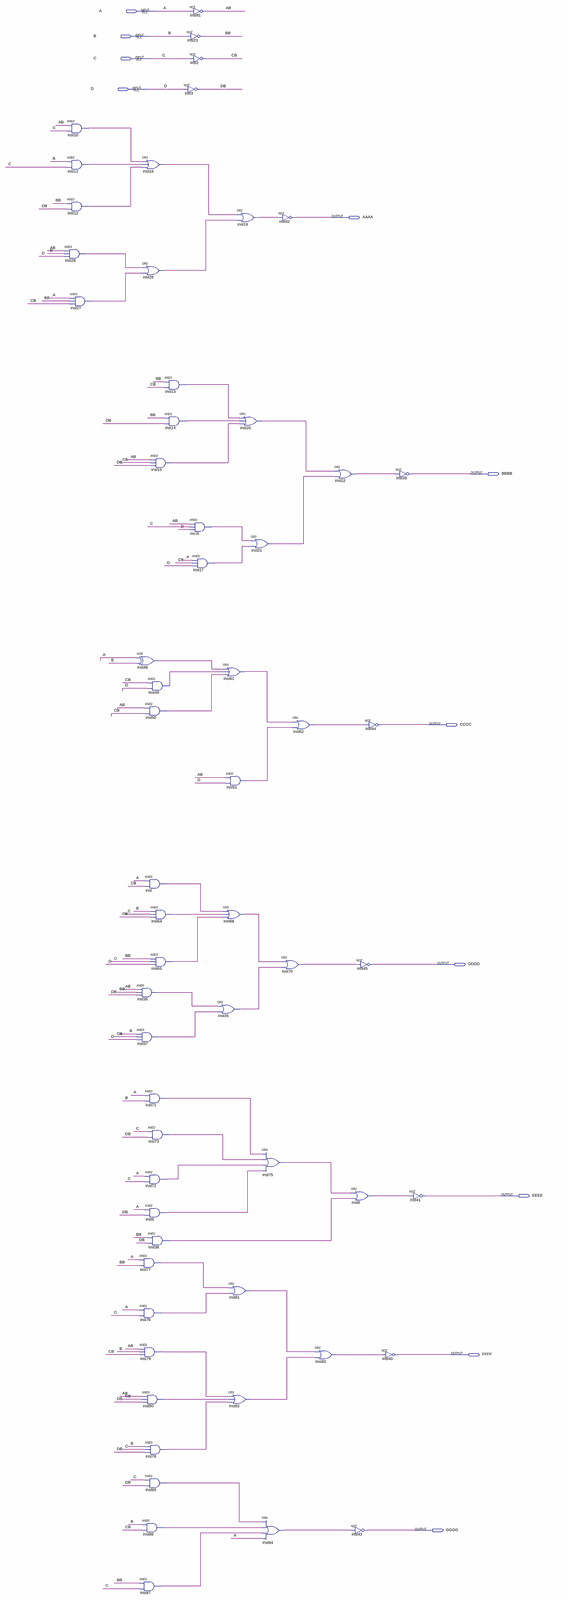
[diagram p0: schematic sheet, whole]
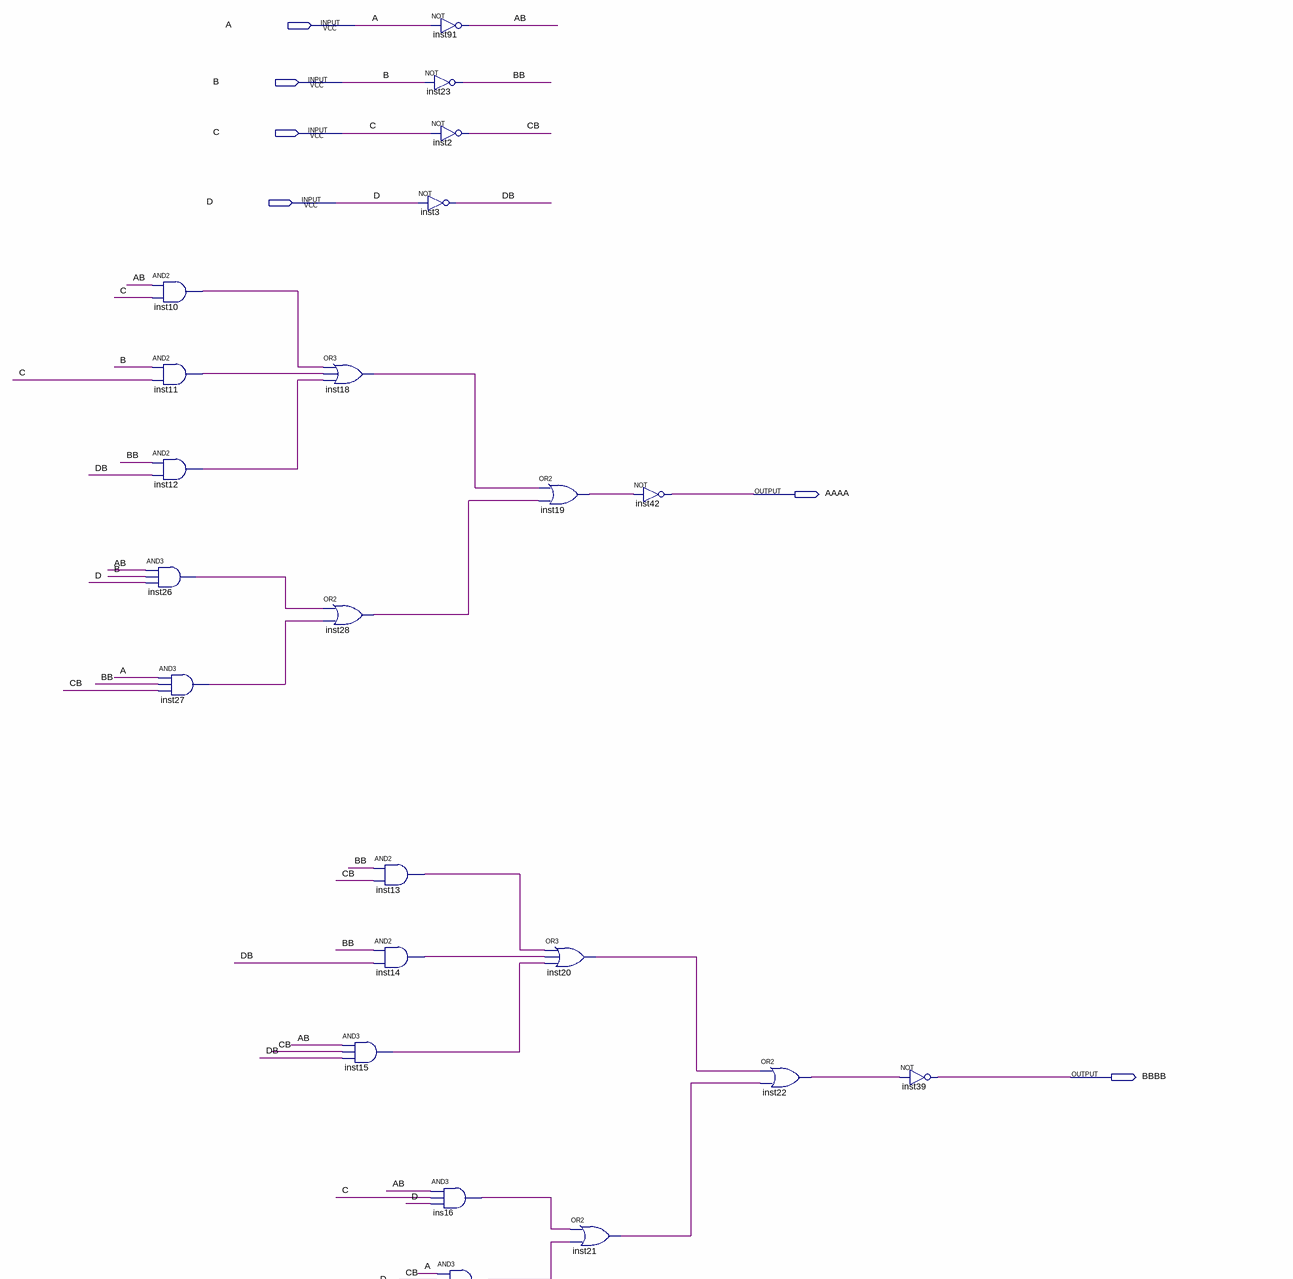
[diagram p1: schematic sheet, upper part]
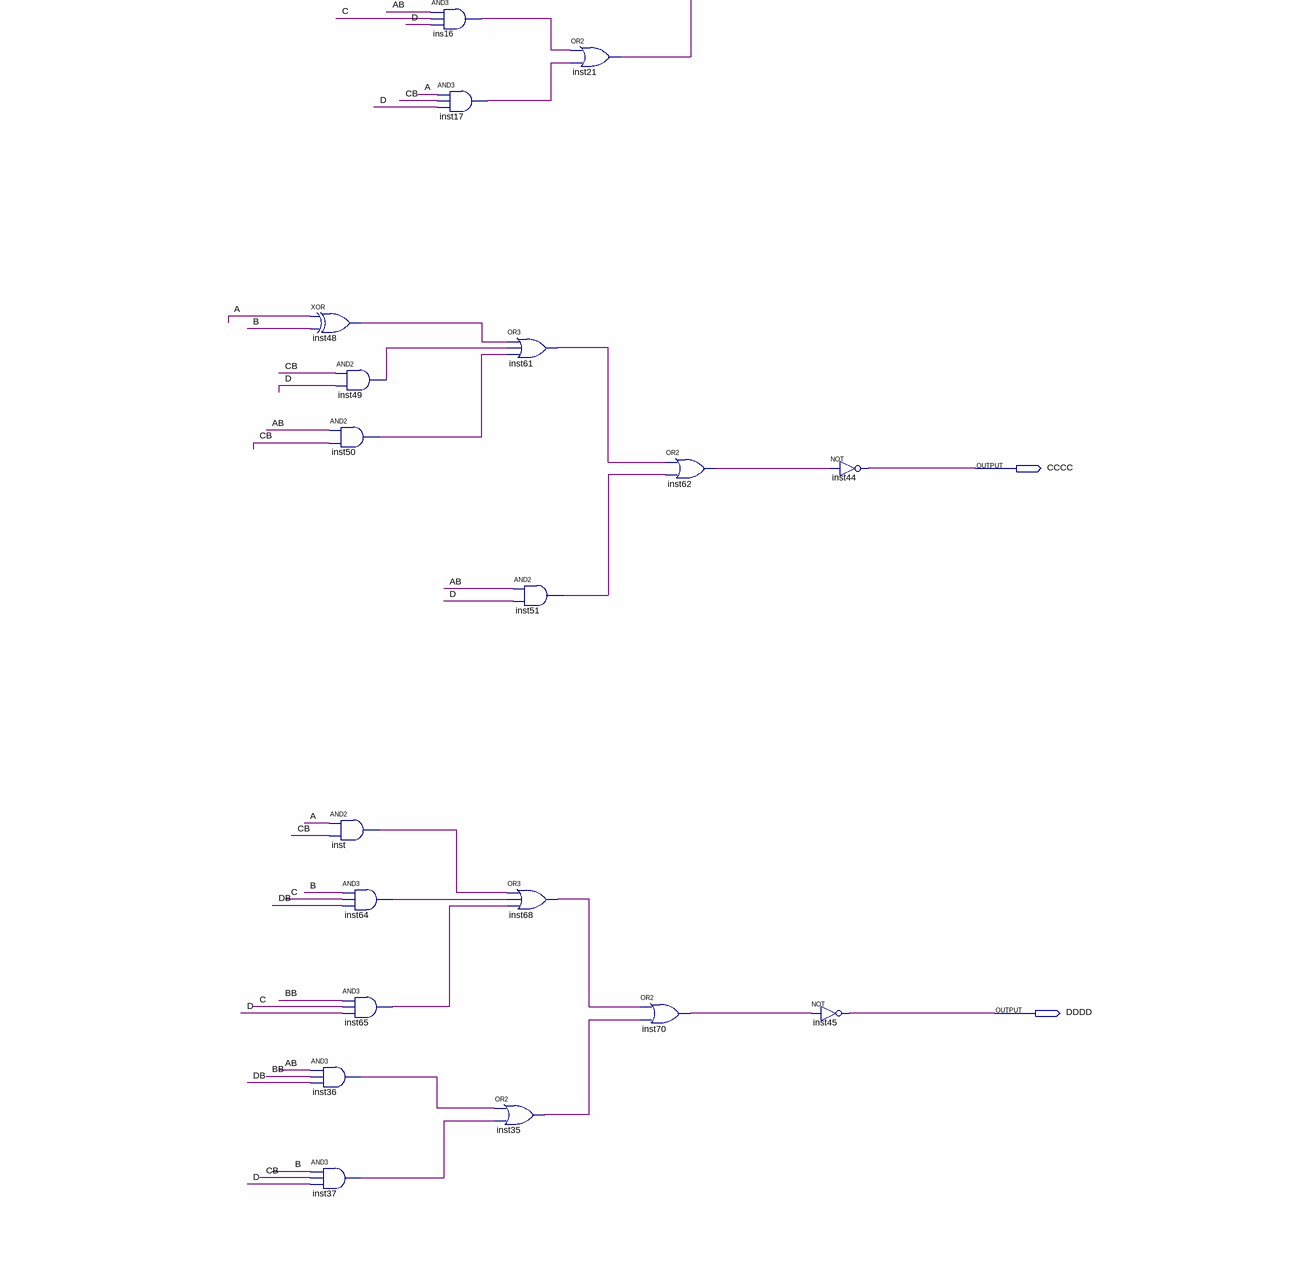
[diagram p2: schematic sheet, middle part]
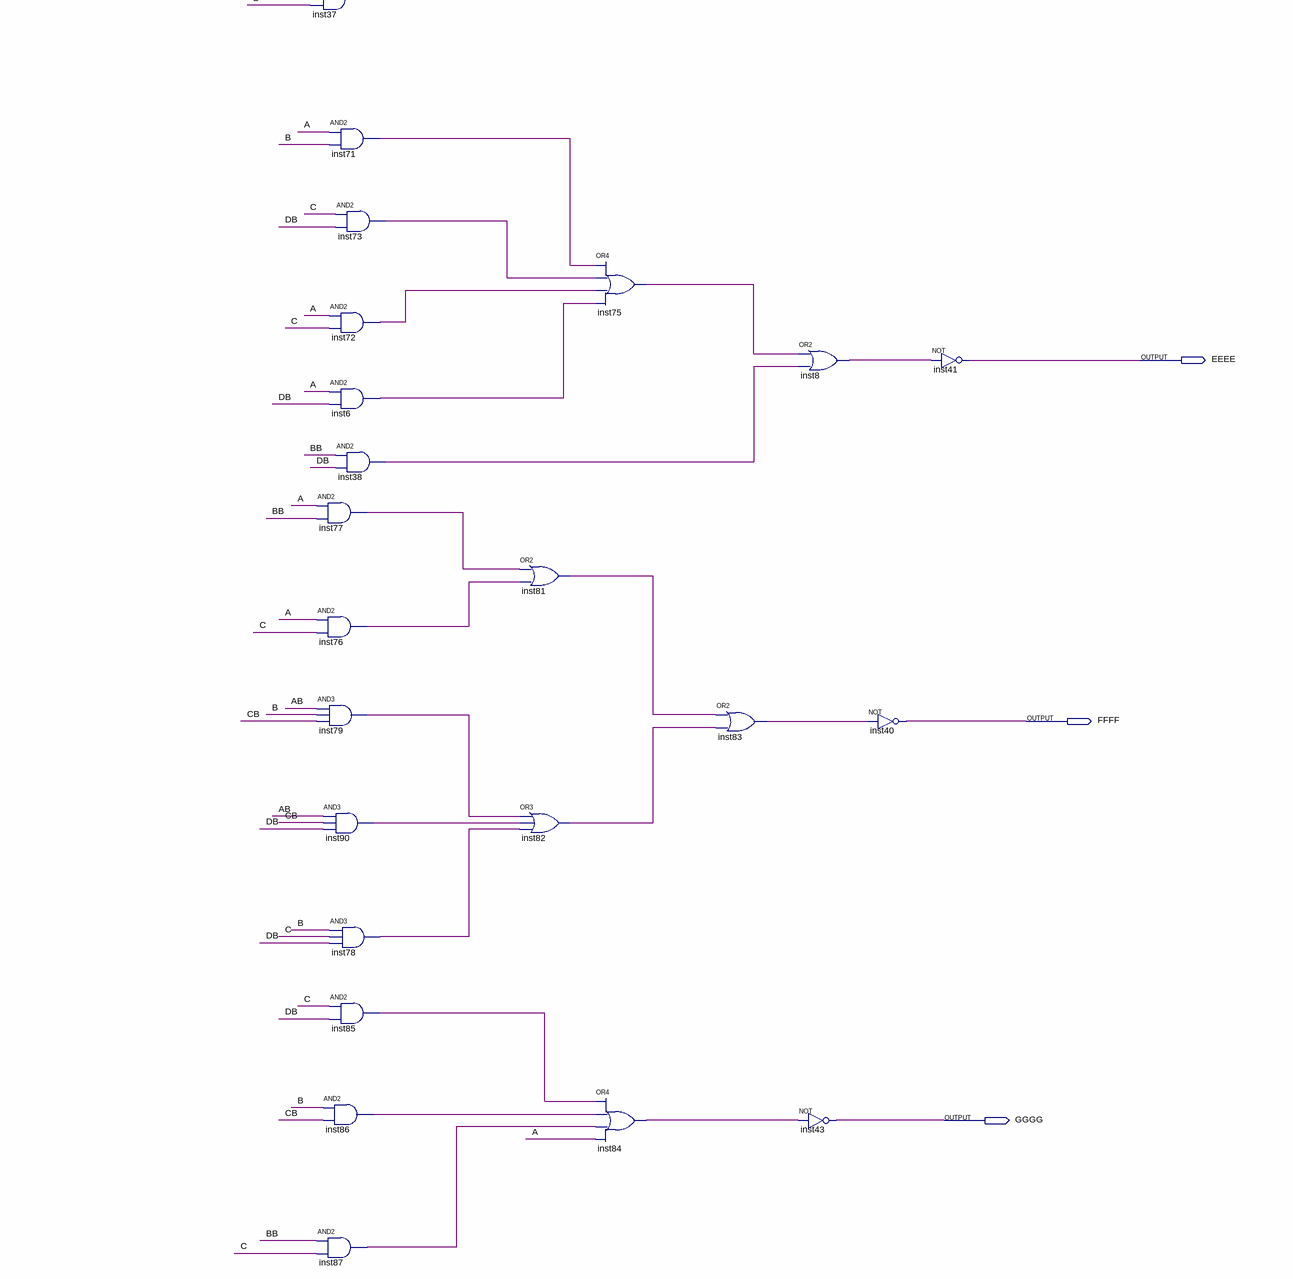
[diagram p3: schematic sheet, lower part]
// Quartus schematic projeto05.bdf as structural Verilog: 60 symbols, 11 pins
module projeto05 (
  input  A,
  input  B,
  input  C,
  input  D,
  output AAAA,
  output BBBB,
  output CCCC,
  output DDDD,
  output EEEE,
  output FFFF,
  output GGGG
);

  wire AB, BB, CB, DB, ins16_out, inst6_out, inst8_out, inst10_out, inst11_out, inst12_out, inst13_out,
       inst14_out, inst15_out, inst17_out, inst18_out, inst19_out, inst20_out, inst21_out, inst22_out,
       inst26_out, inst27_out, inst28_out, inst35_out, inst36_out, inst37_out, inst38_out, inst48_out,
       inst49_out, inst50_out, inst51_out, inst61_out, inst62_out, inst64_out, inst65_out, inst68_out,
       inst70_out, inst71_out, inst72_out, inst73_out, inst75_out, inst76_out, inst77_out, inst78_out,
       inst79_out, inst81_out, inst82_out, inst83_out, inst84_out, inst85_out, inst86_out, inst87_out,
       inst90_out, inst_out;

  and inst10 (inst10_out, AB, C);
  and inst11 (inst11_out, B, C);
  and inst12 (inst12_out, BB, DB);
  and inst26 (inst26_out, AB, B, D);
  and inst27 (inst27_out, A, BB, CB);
  or inst18 (inst18_out, inst10_out, inst11_out, inst12_out);
  or inst28 (inst28_out, inst26_out, inst27_out);
  and inst15 (inst15_out, AB, CB, DB);
  xor inst48 (inst48_out, A, B);
  and inst49 (inst49_out, CB, D);
  and inst50 (inst50_out, AB, CB);
  and inst (inst_out, A, CB);
  and inst64 (inst64_out, B, C, DB);
  and inst65 (inst65_out, BB, C, D);
  and inst36 (inst36_out, AB, BB, DB);
  and inst37 (inst37_out, B, CB, D);
  and inst71 (inst71_out, A, B);
  and inst73 (inst73_out, C, DB);
  and inst72 (inst72_out, A, C);
  and inst6 (inst6_out, A, DB);
  and inst38 (inst38_out, BB, DB);
  and inst77 (inst77_out, A, BB);
  and inst76 (inst76_out, A, C);
  and inst79 (inst79_out, AB, B, CB);
  and inst90 (inst90_out, AB, CB, DB);
  and inst78 (inst78_out, B, C, DB);
  and inst85 (inst85_out, C, DB);
  and inst86 (inst86_out, B, CB);
  and inst87 (inst87_out, BB, C);
  and inst13 (inst13_out, BB, CB);
  and inst14 (inst14_out, BB, DB);
  not inst91 (AB, A);
  not inst23 (BB, B);
  not inst2 (CB, C);
  not inst3 (DB, D);
  and ins16 (ins16_out, AB, C, D);
  and inst17 (inst17_out, A, CB, D);
  or inst61 (inst61_out, inst48_out, inst49_out, inst50_out);
  or inst68 (inst68_out, inst_out, inst64_out, inst65_out);
  or inst35 (inst35_out, inst36_out, inst37_out);
  or inst19 (inst19_out, inst18_out, inst28_out);
  or inst20 (inst20_out, inst13_out, inst14_out, inst15_out);
  and inst51 (inst51_out, AB, D);
  or inst81 (inst81_out, inst77_out, inst76_out);
  or inst82 (inst82_out, inst79_out, inst90_out, inst78_out);
  or inst21 (inst21_out, ins16_out, inst17_out);
  or inst75 (inst75_out, inst71_out, inst73_out, inst72_out, inst6_out);
  or inst84 (inst84_out, inst85_out, inst86_out, inst87_out, A);
  not inst42 (AAAA, inst19_out);
  or inst70 (inst70_out, inst68_out, inst35_out);
  or inst62 (inst62_out, inst61_out, inst51_out);
  or inst22 (inst22_out, inst20_out, inst21_out);
  or inst83 (inst83_out, inst81_out, inst82_out);
  not inst45 (DDDD, inst70_out);
  or inst8 (inst8_out, inst75_out, inst38_out);
  not inst43 (GGGG, inst84_out);
  not inst44 (CCCC, inst62_out);
  not inst39 (BBBB, inst22_out);
  not inst40 (FFFF, inst83_out);
  not inst41 (EEEE, inst8_out);
endmodule
